# EAGLE design LowVBoard_01 (EAGLE 9.1.3)
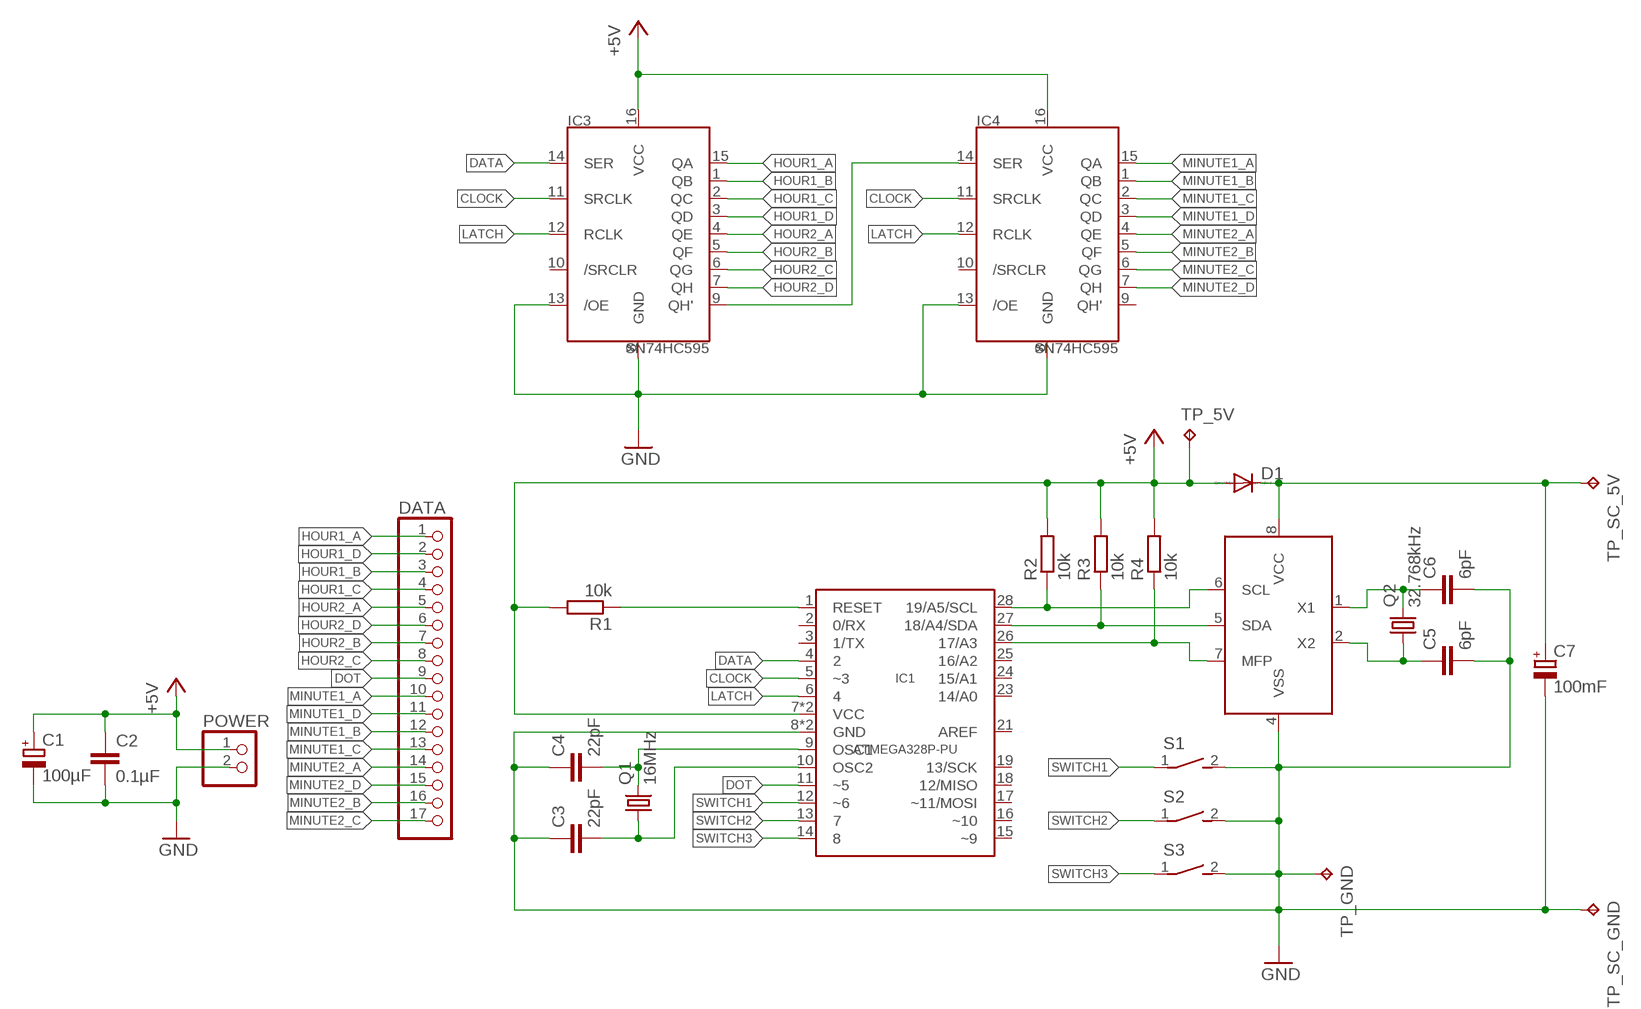
[diagram p0: schematic, sheet 1]

## Parts
C1  100µF  CPOL-EUE2-5  [E2-5]
C2  0.1µF  C-EU025-024X044  [C025-024X044]
C3  22pF  C-EU025-024X044  [C025-024X044]
C4  22pF  C-EU025-024X044  [C025-024X044]
C5  6pF  C-EU025-024X044  [C025-024X044]
C6  6pF  C-EU025-024X044  [C025-024X044]
C7  100mF  FTW0H104ZF  [SUPERCAP-11.5]
D1  DIODE-DO201-15  [DO201-15]
DATA  PINHD-1X17  [1X17]
IC1  ATMEGA328P-PU  [DIP28]
IC2  MCP7940M  MCP7940M-I/P  [DIL8]
IC3  SN74HC595  [DIL16]
IC4  SN74HC595  [DIL16]
POWER  PINHD-1X2  [1X02]
Q1  16MHz  CRYSTALHC49S  [HC49/S]
Q2  32.768kHz  CFS-206  [CFS-206]
R1  10k  R-EU_0207/7  [0207/7]
R2  10k  R-EU_0207/7  [0207/7]
R3  10k  R-EU_0207/7  [0207/7]
R4  10k  R-EU_0207/7  [0207/7]
S1  GPTS203211B  [GPTS203211B]
S2  GPTS203211B  [GPTS203211B]
S3  GPTS203211B  [GPTS203211B]
TP_5V  TPPAD1-13  [P1-13]
TP_GND  TPPAD1-13  [P1-13]
TP_SC_5V  TPPAD1-13  [P1-13]
TP_SC_GND  TPPAD1-13  [P1-13]

## Nets
+5V [+5V]: C1.+ C2.1 D1.A IC1.7(VCC) IC1.20(VCC) IC3.16(VCC) IC4.16(VCC) POWER.1 R1.2 R2.2 R3.2 R4.2 TP_5V.TP
CLOCK: IC1.5(~3) IC3.11(SRCLK) IC4.11(SRCLK)
DATA: IC1.4 IC3.14(SER)
DOT: DATA.9 IC1.11(~5)
GND [GND]: C1.- C2.2 C3.1 C4.1 C5.2 C6.2 C7.- IC1.8(GND) IC1.22(GND) IC2.4(VSS) IC3.8(GND) IC3.13(/OE) IC4.8(GND) IC4.13(/OE) POWER.2 S1.2(S) S2.2(S) S3.2(S) TP_GND.TP TP_SC_GND.TP
HOUR1_A: DATA.1 IC3.15(QA)
HOUR1_B: DATA.3 IC3.1(QB)
HOUR1_C: DATA.4 IC3.2(QC)
HOUR1_D: DATA.2 IC3.3(QD)
HOUR2_A: DATA.5 IC3.4(QE)
HOUR2_B: DATA.7 IC3.5(QF)
HOUR2_C: DATA.8 IC3.6(QG)
HOUR2_D: DATA.6 IC3.7(QH)
LATCH: IC1.6 IC3.12(RCLK) IC4.12(RCLK)
MINUTE1_A: DATA.10 IC4.15(QA)
MINUTE1_B: DATA.12 IC4.1(QB)
MINUTE1_C: DATA.13 IC4.2(QC)
MINUTE1_D: DATA.11 IC4.3(QD)
MINUTE2_A: DATA.14 IC4.4(QE)
MINUTE2_B: DATA.16 IC4.5(QF)
MINUTE2_C: DATA.17 IC4.6(QG)
MINUTE2_D: DATA.15 IC4.7(QH)
N$1: C7.+ D1.C IC2.8(VCC) TP_SC_5V.TP
N$53: C4.2 IC1.9(OSC1) Q1.2
N$54: C3.2 IC1.10(OSC2) Q1.1
N$56: IC1.1(RESET) R1.1
N$57: IC1.28(19/A5/SCL) IC2.6(SCL) R2.1
N$58: IC1.27(18/A4/SDA) IC2.5(SDA) R3.1
N$59: IC1.26(17/A3) IC2.7(MFP) R4.1
N$60: C6.1 IC2.1(X1) Q2.P$2
N$61: C5.1 IC2.2(X2) Q2.P$1
N$69: IC3.9(QH') IC4.14(SER)
SWITCH1: IC1.12(~6) S1.1(P)
SWITCH2: IC1.13 S2.1(P)
SWITCH3: IC1.14 S3.1(P)
Unconnected: IC1.2(0/RX) IC1.3(1/TX) IC1.15(~9) IC1.16(~10) IC1.17(~11/MOSI) IC1.18(12/MISO) IC1.19(13/SCK) IC1.21(AREF) IC1.23(14/A0) IC1.24(15/A1) IC1.25(16/A2) IC3.10(/SRCLR) IC4.9(QH') IC4.10(/SRCLR)

## Library data of the parts
C1 = resistor:CPOL-EU: POLARIZED CAPACITOR, European symbol
C2-C6 = resistor:C-EU: CAPACITOR, European symbol
C7 = Nixie:FTW0H104ZF
D1 = diode:DIODE-: DIODE
DATA = pinhead:PINHD-1X17: PIN HEADER
IC1 = Programmer:ATMEGA328P-PU
IC2 = Nixie:MCP7940M-I/P
IC3 IC4 = Nixie:SN74HC595
POWER = pinhead:PINHD-1X2: PIN HEADER
Q1 = crystal:CRYSTAL: CRYSTAL; OC_FARNELL: 1667008; OC_NEWARK: unknown
Q2 = Nixie:CFS-206
R1-R4 = resistor:R-EU_: RESISTOR, European symbol
S1-S3 = Nixie:GPTS203211B
TP_5V TP_GND TP_SC_5V TP_SC_GND = testpad:TP: Test pad

## Net classes
0 SIGNAL: width 0.203 mm, clearance 0.203 mm
1 +5V: width 0.406 mm, clearance 0.203 mm
2 GND: clearance 0.203 mm

## Board
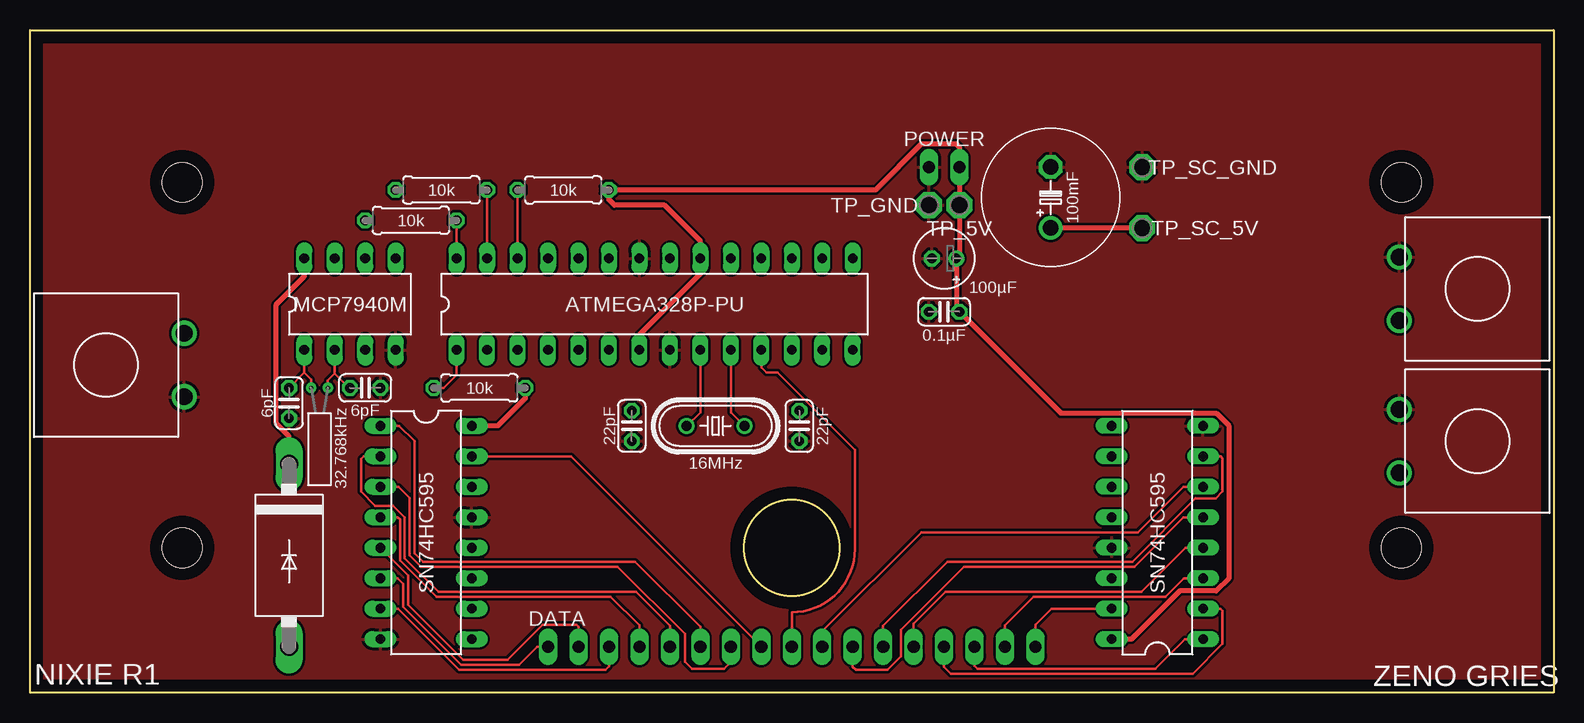
[diagram p1: board, top side]
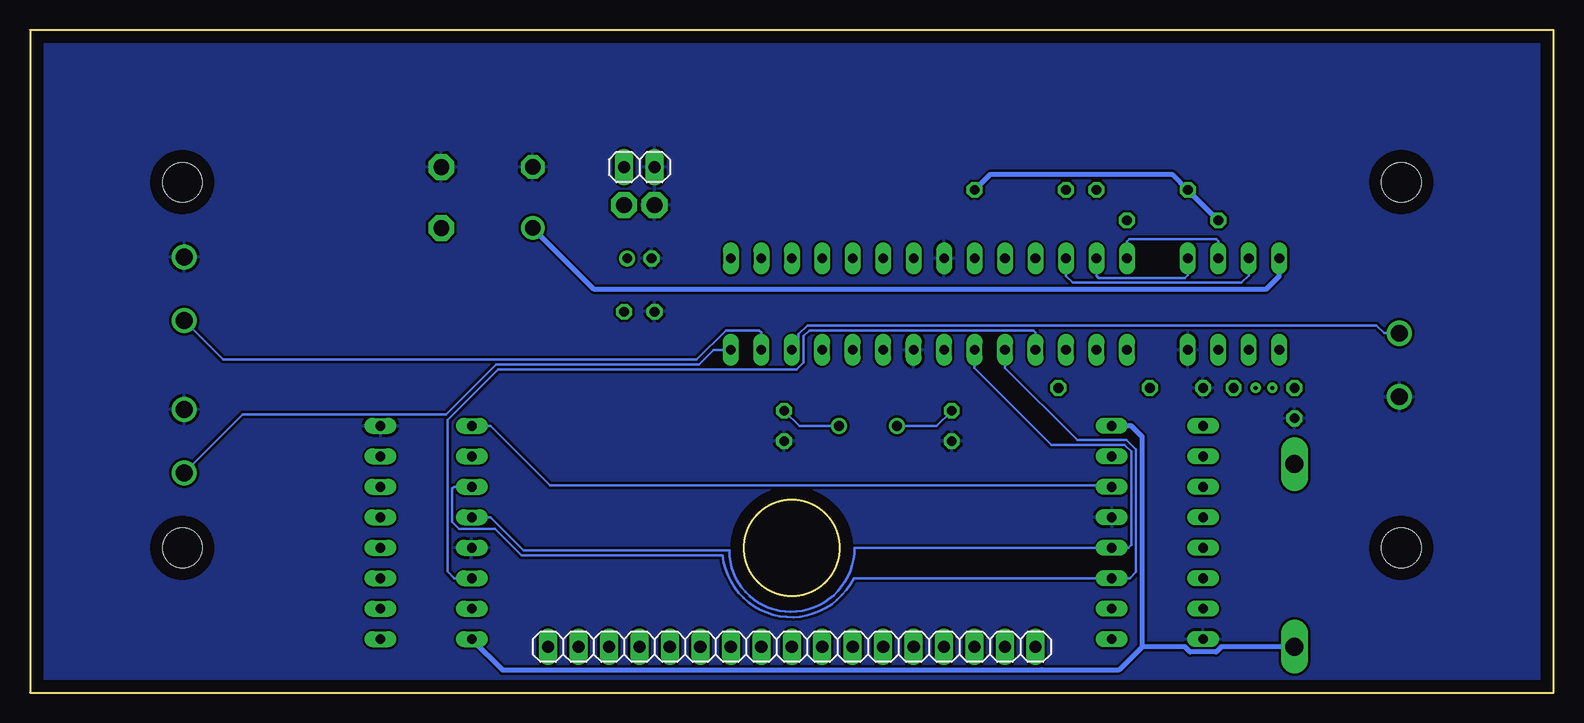
[diagram p2: board, bottom side, seen from below]

Size 127 x 55.25 mm. Coordinates in mm from the lower left corner, seen from the top.
Outline: 0,0 0,55.25 127,55.25 127,0 0,0
Outline: circle at 63.5,12.07 radius 4
Copper layers (1*16): Top 0.035mm / dielectric 1.5mm / Bottom 0.035mm
Design rules "default *": minimum track width 6mil, minimum drill 0.35mm, track to track 8mil, track to pad 8mil, pad to pad 8mil, via to via 8mil, smd to smd 6mil, copper to edge 40mil, drill to drill 6mil, minimum pad ring 10mil, minimum via ring 8mil, stop-mask expansion 4mil, vias tented up to drill 0mil, thermal gap 10mil
Holes 3.3 mm at 12.7,42.55 12.7,12.07 114.3,12.07 114.3,42.55

### Footprints (pad centres in the part's own frame; a part is rotated, then mirrored left to right if it is on the bottom)
E2-5 = drill 0.813 pad 1.27: + -1.016,0 | drill 0.813 pad 1.27 octagon: - 1.016,0
C025-024X044 = drill 0.813 octagon: 1 -1.27,0; 2 1.27,0
SUPERCAP-11.5 = drill 1.3: + -2.54,0 | drill 1.3 octagon: - 2.54,0
DO201-15 = drill 1.499 long: A 7.62,0; C -7.62,0
1X17 = drill 1.016 long: 1 -20.32,0; 2 -17.78,0; 3 -15.24,0; 4 -12.7,0; 5 -10.16,0; 6 -7.62,0; 7 -5.08,0; 8 -2.54,0; 9 0,0; 10 2.54,0; 11 5.08,0; 12 7.62,0; 13 10.16,0; 14 12.7,0; 15 15.24,0; 16 17.78,0; 17 20.32,0
DIP28 = drill 0.813 long: 1 -16.51,-3.81; 2 -13.97,-3.81; 3 -11.43,-3.81; 4 -8.89,-3.81; 5 -6.35,-3.81; 6 -3.81,-3.81; 7 -1.27,-3.81; 8 1.27,-3.81; 9 3.81,-3.81; 10 6.35,-3.81; 11 8.89,-3.81; 12 11.43,-3.81; 13 13.97,-3.81; 14 16.51,-3.81; 15 16.51,3.81; 16 13.97,3.81; 17 11.43,3.81; 18 8.89,3.81; 19 6.35,3.81; 20 3.81,3.81; 21 1.27,3.81; 22 -1.27,3.81; 23 -3.81,3.81; 24 -6.35,3.81; 25 -8.89,3.81; 26 -11.43,3.81; 27 -13.97,3.81; 28 -16.51,3.81
DIL8 = drill 0.813 long: 1 -3.81,-3.81; 2 -1.27,-3.81; 3 1.27,-3.81; 4 3.81,-3.81; 5 3.81,3.81; 6 1.27,3.81; 7 -1.27,3.81; 8 -3.81,3.81
DIL16 = drill 0.813 long: 1 -8.89,-3.81; 2 -6.35,-3.81; 3 -3.81,-3.81; 4 -1.27,-3.81; 5 1.27,-3.81; 6 3.81,-3.81; 7 6.35,-3.81; 8 8.89,-3.81; 9 8.89,3.81; 10 6.35,3.81; 11 3.81,3.81; 12 1.27,3.81; 13 -1.27,3.81; 14 -3.81,3.81; 15 -6.35,3.81; 16 -8.89,3.81
1X02 = drill 1.016 long: 1 -1.27,0; 2 1.27,0
HC49/S = drill 0.813: 1 -2.413,0; 2 2.413,0
CFS-206 = drill 0.35: P$1 0,-0.7; P$2 0,0.7
0207/7 = drill 0.813 octagon: 1 -3.81,0; 2 3.81,0
GPTS203211B = drill 1.4: 1 6.5,2.65; 2 6.5,-2.65
P1-13 = drill 1.321 pad 2.159 octagon: TP 0,0

### Placement (x,y rotation side)
C1  76.2,36.2 180 top
C2  76.2,31.75 180 top
C3  64.14,22.23 90 top
C4  50.16,22.23 90 top
C5  27.94,25.41 0 top
C6  21.59,24.14 270 top
C7  85.09,41.28 90 top
D1  21.59,11.43 270 top
DATA  63.5,3.82 0 bottom
IC1  52.07,32.39 0 top
IC2  26.67,32.39 0 top
IC3  93.98,13.34 90 top
IC4  33.02,13.34 270 top
POWER  76.2,43.82 0 bottom
Q1  57.15,22.23 180 top
Q2  24.13,25.41 90 top
R1  37.47,25.41 0 top
R2  31.75,39.38 180 top
R3  34.29,41.91 180 top
R4  44.45,41.91 0 top
S1  6.35,27.31 0 top
S2  120.65,33.66 180 top
S3  120.65,20.96 180 top
TP_5V  77.47,40.64 0 top
TP_GND  74.93,40.64 0 top
TP_SC_5V  92.71,38.74 0 top
TP_SC_GND  92.71,43.82 0 top

### Tracks (layer width: path | path; a pad name or v marks a point on that pad's centre or on a via)
+5V
  Top 0.406: IC3.16 91.82,4.45 95.83,8.46 98.89,8.46 99.92,9.49 99.92,22.27 98.89,23.3 85.93,23.3 C2.1 77.22,32.01 C1.+ 77.47,36.45 TP_5V.TP POWER.1 77.47,45.47 77.19,45.75 74.32,45.75 70.48,41.91 R4.2 48.26,41.1 48.72,40.64 52.88,40.64 55.88,37.65 IC1.20 55.88,34.93 50.8,29.85 IC1.7 | IC4.16 38.99,22.23 41.27,24.52 R1.2
  Bottom 0.406: IC3.16 87.61,1.89 42.7,1.89 42.67,1.91 36.2,1.91 34.29,3.82 | IC4.16 35.2,22.23 34.29,21.32 34.29,3.82 | R4.2 46.99,43.18 31.75,43.18 R3.2 R2.2 | D1.A 27.68,3.82 28.11,3.38 30.31,3.38 30.74,3.82 34.29,3.82
CLOCK
  Bottom 0.203: IC3.11 91.66,17.15 91.8,17.02 91.8,14.21 91.23,13.64 88.23,13.64 86.02,11.43 69.27,11.43 arc-142 58.61,9.04 58.31,9.53 IC4.11 35.31,9.53 34.8,10.04 34.8,20.26 35.6,21.06 39.7,21.06 45.72,27.08 IC1.5
DATA
  Bottom 0.203: IC3.14 91.64,9.53 92.2,10.09 92.2,22.74 87.99,26.95 63.1,26.95 62.53,27.52 62.53,29.71 62.04,30.21 43.36,30.21 43.18,30.03 IC1.4
DOT
  Top 0.203: DATA.9 63.5,6.7 arc90 68.76,11.96 68.76,20.25 62.33,26.68 61.39,26.68 60.96,27.11 IC1.11
GND
  pour Top: 0,55.25 0,0.01 127,0.01 127,55.25
  pour Bottom: 0,55.25 0,0.01 127,0.01 127,55.25
HOUR1_A
  Top 0.203: IC3.15 85.17,6.99 83.82,5.64 DATA.1
HOUR1_B
  Top 0.203: DATA.3 78.74,2.23 78.98,1.99 93.8,1.99 96.27,4.45 IC3.1
HOUR1_C
  Top 0.203: DATA.4 76.2,2.14 76.76,1.58 96.94,1.58 99.42,4.05 99.42,6.81 99.23,6.99 IC3.2
HOUR1_D
  Top 0.203: IC3.3 96.18,9.53 94.63,7.98 83.64,7.98 81.28,5.62 DATA.2
HOUR2_A
  Top 0.203: DATA.5 73.66,5.72 76.33,8.39 92.63,8.39 96.32,12.07 IC3.4
HOUR2_B
  Top 0.203: DATA.7 68.58,2.16 68.83,1.91 71.49,1.91 72.59,3.02 72.59,5.23 77.86,10.49 92.05,10.49 96.16,14.61 IC3.5
HOUR2_C
  Top 0.203: DATA.8 66.04,5.08 74.3,13.34 92.34,13.34 96.16,17.15 IC3.6
HOUR2_D
  Top 0.203: DATA.6 71.12,5.54 76.48,10.9 91.88,10.9 97.16,16.19 98.85,16.19 99.42,16.75 99.42,19.53 99.26,19.69 IC3.7
LATCH
  Bottom 0.203: IC3.12 88.62,14.61 85.85,11.84 68.71,11.84 arc-90 63.6,6.73 arc-90 58.26,12.07 IC4.12 35.44,12.07 35.2,12.3 35.2,20.09 35.77,20.66 41.83,20.66 48.26,27.08 IC1.6
MINUTE1_A
  Top 0.203: IC4.15 45.09,19.69 DATA.10
MINUTE1_B
  Top 0.203: DATA.12 55.88,5.47 50.44,10.9 32.76,10.9 32.05,11.6 32.05,20.96 30.79,22.23 IC4.1
MINUTE1_C
  Top 0.203: IC4.2 27.81,19.69 27.58,19.46 27.58,16.75 28.76,15.57 30.27,15.57 31.24,14.6 31.24,11.2 34.05,8.39 50.52,8.39 53.34,5.57 DATA.13
MINUTE1_D
  Top 0.203: IC4.3 30.71,17.15 31.65,16.21 31.65,11.43 32.59,10.49 49,10.49 54.61,4.88 54.61,2.54 55.17,1.99 57.86,1.99 58.42,2.54 DATA.11
MINUTE2_A
  Top 0.203: DATA.14 50.8,5.59 48.41,7.98 33.88,7.98 30.84,11.03 30.84,14.43 30.66,14.61 IC4.4
MINUTE2_B
  Top 0.203: IC4.5 31.52,9.76 31.52,7.3 36.1,2.72 39.82,2.72 42.74,5.64 45.54,5.64 45.72,5.47 DATA.16
MINUTE2_C
  Top 0.203: DATA.17 42.27,3.82 40.77,2.32 35.93,2.32 31.11,7.13 31.11,9.05 30.63,9.53 IC4.6
MINUTE2_D
  Top 0.203: IC4.7 30.68,6.99 35.76,1.91 47.98,1.91 48.26,2.19 DATA.15
N$1
  Top 0.406: D1.C 21.59,21.36 20.52,22.42 20.52,32.36 22.86,34.7 IC2.8 | TP_SC_5V.TP C7.+
  Bottom 0.406: C7.+ 80.01,33.66 23.93,33.66 22.86,34.73 IC2.8
N$53
  Top 0.203: Q1.2 55.88,23.37 IC1.9
  Bottom 0.203: C4.2 51.44,22.23 Q1.2
N$54
  Top 0.203: IC1.10 58.42,23.37 Q1.1
  Bottom 0.203: Q1.1 62.87,22.23 C3.2
N$56
  Top 0.203: IC1.1 35.56,26.47 34.49,25.41 R1.1
N$57
  Top 0.203: R2.1 IC1.28
  Bottom 0.203: IC2.6 27.94,37.65 28.12,37.83 35.36,37.83 35.56,37.62 IC1.28
N$58
  Top 0.203: R3.1 IC1.27
  Bottom 0.203: IC2.5 30.48,34.8 30.71,34.57 37.92,34.57 38.1,34.75 IC1.27
N$59
  Top 0.203: R4.1 IC1.26
  Bottom 0.203: IC2.7 25.4,34.78 26.01,34.17 40.08,34.17 40.64,34.73 IC1.26
N$60
  Top 0.203: IC2.1 22.86,26.68 | 22.86,26.68 C6.1 | Q2.P$2 23.43,26.11 22.86,26.68
N$61
  Top 0.203: IC2.2 25.4,26.61 | 25.4,26.61 24.83,26.04 Q2.P$1 | C5.1 26.61,25.41 25.4,26.61
N$69
  Bottom 0.203: IC3.9 88.62,22.23 83.65,17.26 36.94,17.26 IC4.14
SWITCH1
  Bottom 0.203: IC1.12 62.94,29.14 62.94,29.88 62.21,30.61 14.77,30.61 14.12,29.96 S1.1
SWITCH2
  Bottom 0.203: S2.1 110.91,27.77 71.42,27.77 68.98,30.21 66.24,30.21 66.04,30 IC1.13
SWITCH3
  Bottom 0.203: IC1.14 70.03,28.58 71.25,27.36 88.15,27.36 92.32,23.2 109.27,23.2 S3.1

### Text on the board
tNames: NIXIE R1 | ZENO GRIES